# EAGLE schematic SchematicoCombinatore (EAGLE 9.5.2)
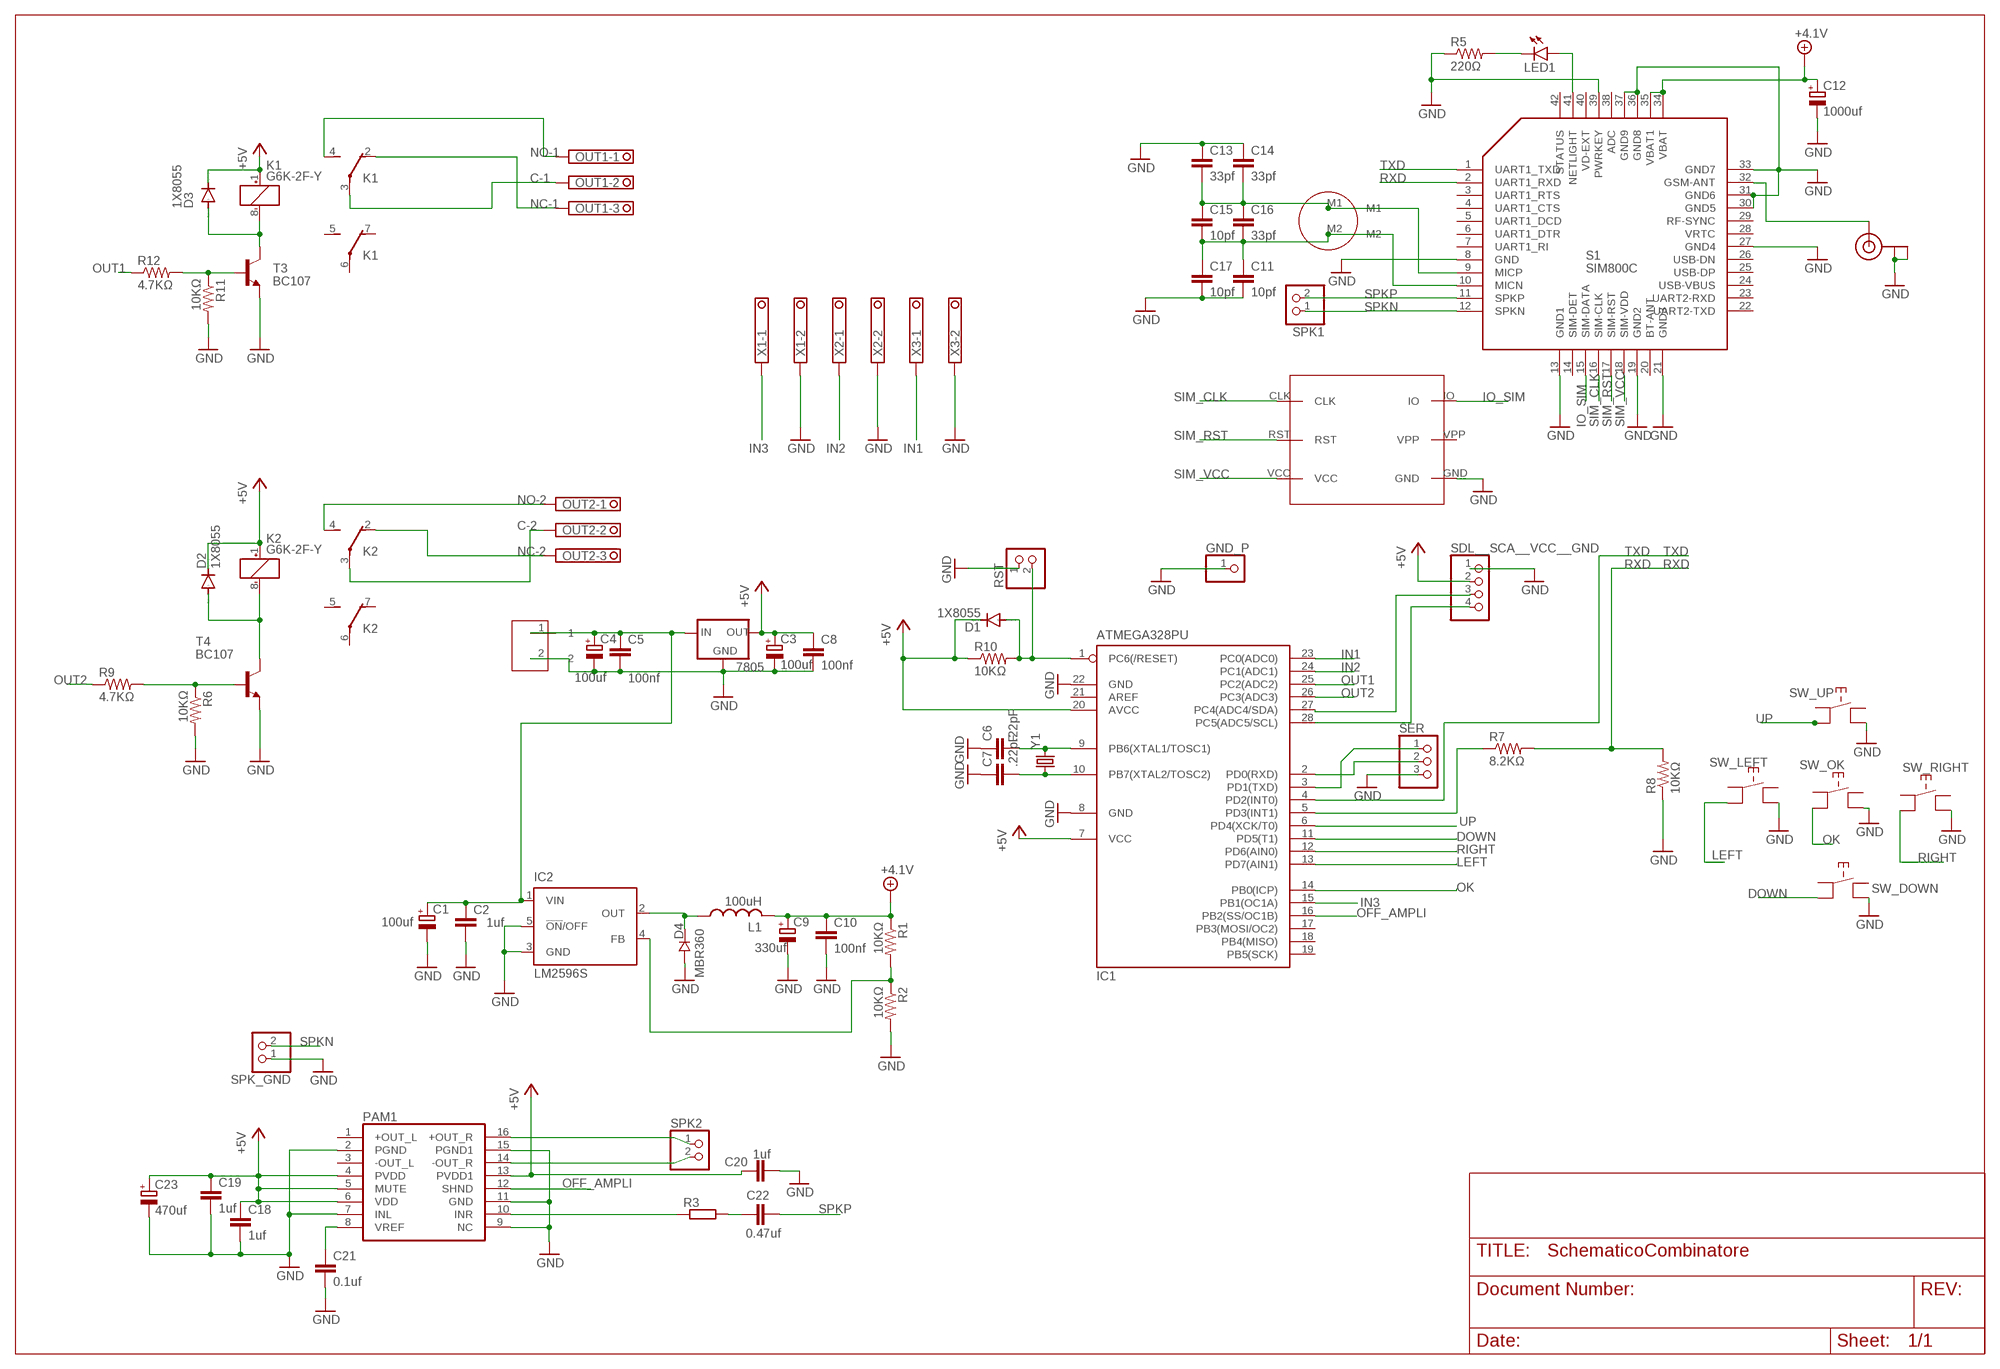
[diagram p0: schematic, sheet 1]

## Parts
7805  7805  V_REG_78XXSIDE  [78XXL]
ALIM  CONNETTORE_ALIM  [CONNETTORE_ALIM]
C1  100uf  CPOL-EU153CLV-0605  [153CLV-0605]
C2  1uf  C-EUC0805  [C0805]
C3  100uf  CPOL-EU153CLV-0605  [153CLV-0605]
C4  100uf  CPOL-EU153CLV-0605  [153CLV-0605]
C5  100nf  C-EU050-024X044  [C050-024X044]
C6  .22pF  CAPPTH  [CAP-PTH-SMALL]
C7  .22pF  CAPPTH  [CAP-PTH-SMALL]
C8  100nf  C-EU050-024X044  [C050-024X044]
C9  330uf  CPOL-EU153CLV-0605  [153CLV-0605]
C10  100nf  C-EU050-024X044  [C050-024X044]
C11  10pf  C-EUC0805  [C0805]
C12  1000uf  CPOL-EU140CLH-1014  [140CLH-1014]
C13  33pf  C-EUC0805  [C0805]
C14  33pf  C-EUC0805  [C0805]
C15  10pf  C-EUC0805  [C0805]
C16  33pf  C-EUC0805  [C0805]
C17  10pf  C-EUC0805  [C0805]
C18  1uf  C-EUC0805  [C0805]
C19  1uf  C-EUC0805  [C0805]
C20  1uf  C-EUC0805  [C0805]
C21  0.1uf  C-EUC0805  [C0805]
C22  0.47uf  C-EUC0805  [C0805]
C23  470uf  CPOL-EU153CLV-0605  [153CLV-0605]
D1  1X8055  1N4004  [DO41-10]
D2  1X8055  1N4004  [DO41-10]
D3  1X8055  1N4004  [DO41-10]
D4  MBR360  [SR360_DIODO_SMD]
GND_P  PINHD-1X1  [1X01]
IC1  ATMEGA328PU  MEGA8-P  [DIL28-3]
IC2  LM2596S  [TO263-5]
K1  G6K-2F-Y  [G6K-2F-Y]
K2  G6K-2F-Y  [G6K-2F-Y]
L1  100uH  L-US0204/7  [0204/7]
LED1  LED3MM  [LED3MM]
MIC2  MICROPHONE  [MICROFONO1]
OUT1  1751251  [1751251]
OUT2  NC  1751251  [1751251]
PAM1  PAM8403  [SOP-16]
R1  10KΩ  RESISTOR0402-RES  [0402-RES]
R2  10KΩ  RESISTOR0402-RES  [0402-RES]
R3  R-EU_R0402  [R0402]
R5  220Ω  RESISTOR0402-RES  [0402-RES]
R6  10KΩ  RESISTOR0402-RES  [0402-RES]
R7  8.2KΩ  RESISTOR0402-RES  [0402-RES]
R8  10KΩ  RESISTOR0402-RES  [0402-RES]
R9  4.7KΩ  RESISTOR0402-RES  [0402-RES]
R10  10KΩ  RESISTOR0402-RES  [0402-RES]
R11  10KΩ  RESISTOR0402-RES  [0402-RES]
R12  4.7KΩ  RESISTOR0402-RES  [0402-RES]
RST  PINHD-1X2  [1X02]
S1  SIM800C  [SIM800C]
SDL__SCA__VCC__GND  PINHD-1X4  [1X04]
SER  PINHD-1X3  [1X03]
SPK1  PINHD-1X2  [1X02]
SPK2  PINHD-1X2  [1X02]
SPK_GND  PINHD-1X2  [1X02]
SW_DOWN  PULSANTE_DIP_SWITCH  [PULSANTE_DIP_SWITCH]
SW_LEFT  PULSANTE_DIP_SWITCH  [PULSANTE_DIP_SWITCH]
SW_OK  PULSANTE_DIP_SWITCH  [PULSANTE_DIP_SWITCH]
SW_RIGHT  PULSANTE_DIP_SWITCH  [PULSANTE_DIP_SWITCH]
SW_UP  PULSANTE_DIP_SWITCH  [PULSANTE_DIP_SWITCH]
T3  BC107  [TO18]
T4  BC107  [TO18]
U$1  U.FL  [U.FL]
U$2  NANO_SIM_CARD_HOLDER  [NANO_SIM_CARD_HOLDER]
X1  1751248  [1751248]
X2  1751248  [1751248]
X3  1751248  [1751248]
Y1  CRYSTALHC49US  [HC49US]

## Nets
+4.1V: C9.+ C10.1 C12.+ L1.2 R1.1 S1.34(VBAT) S1.35(VBAT1)
+5V: 7805.OUT C3.+ C8.1 C18.1 C19.1 C20.1 C23.+ D1.C D2.C D3.C IC1.7(VCC) IC1.20(AVCC) K1.1(1:+) K2.1(1:+) PAM1.4(PVDD) PAM1.5(MUTE) PAM1.6(VDD) PAM1.13(PVDD1) R10.1 SDL__SCA__VCC__GND.2
+12: 7805.IN ALIM.1 C1.+ C2.1 C4.+ C5.1 IC2.1(VIN)
C-1: K1.3(2:P) OUT1.2
C-2: K2.3(2:P) OUT2.2
DOWN: IC1.11(PD5(T1)) SW_DOWN.3
GND: 7805.GND ALIM.2 C1.- C2.2 C3.- C4.- C5.2 C6.1 C7.1 C8.2 C9.- C10.2 C11.2 C12.- C13.1 C14.1 C17.2 C18.2 C19.2 C20.2 C21.2 C23.- D4.P$1 GND_P.1 IC1.8(GND) IC1.22(GND) IC2.3(GND) IC2.5(!ON!/OFF) PAM1.2(PGND) PAM1.7(INL) PAM1.9(NC) PAM1.11(GND) PAM1.15(PGND1) R2.2 R5.1 R6.2 R8.1 R11.2 RST.1 S1.8(GND) S1.13(GND1) S1.19(GND2) S1.21(GND3) S1.27(GND4) S1.30(GND5) S1.31(GND6) S1.33(GND7) S1.36(GND8) S1.37(GND9) S1.39(PWRKEY) SDL__SCA__VCC__GND.1 SER.3 SPK_GND.1 SW_DOWN.1 SW_LEFT.1 SW_OK.1 SW_RIGHT.1 SW_UP.1 T3.1(E) T4.1(E) U$1.1(GND) U$1.2(GND) U$2.GND X1.2 X2.2 X3.2
IN1: IC1.23(PC0(ADC0)) X3.1
IN2: IC1.24(PC1(ADC1)) X2.1
IN3: IC1.15(PB1(OC1A)) X1.1
IO_SIM: S1.15(SIM-DATA) U$2.IO
LEFT: IC1.13(PD7(AIN1)) SW_LEFT.3
N$1: D1.A IC1.1(PC6(/RESET)) R10.2 RST.2
N$2: C6.2 IC1.9(PB6(XTAL1/TOSC1)) Y1.2
N$3: C7.2 IC1.10(PB7(XTAL2/TOSC2)) Y1.1
N$4: IC1.27(PC4(ADC4/SDA)) SDL__SCA__VCC__GND.3
N$5: IC1.28(PC5(ADC5/SCL)) SDL__SCA__VCC__GND.4
N$6: C11.1 C15.2 C16.2 C17.1 MIC2.M2 S1.10(MICN)
N$7: C13.2 C14.2 C15.1 C16.1 MIC2.M1 S1.9(MICP)
N$8: PAM1.16(+OUT_R) SPK2.1
N$9: D4.P$2 IC2.2(OUT) L1.1
N$10: D2.A K2.8(1:-) T4.3(C)
N$11: D3.A K1.8(1:-) T3.3(C)
N$12: PAM1.14(-OUT_R) SPK2.2
N$13: C21.1 PAM1.8(VREF)
N$15: C22.1 R3.2
N$16: IC1.2(PD0(RXD)) SER.2
N$17: S1.32(GSM-ANT) U$1.3(SIGNAL)
N$18: PAM1.10(INR) R3.1
N$20: IC1.3(PD1(TXD)) SER.1
N$21: LED1.K(C) R5.2
N$22: IC1.5(PD3(INT1)) R7.1
N$26: LED1.A S1.41(NETLIGHT)
N$28: R11.1 R12.2 T3.2(B)
N$29: R6.1 R9.2 T4.2(B)
N$32: IC2.4(FB) R1.2 R2.1
NC-1: K1.2(2:O) OUT1.3
NC-2: K2.2(2:O) OUT2.3
NO-1: K1.4(2:S) OUT1.1
NO-2: K2.4(2:S) OUT2.1
OFF_AMPLI: IC1.16(PB2(SS/OC1B)) PAM1.12(SHND)
OK: IC1.14(PB0(ICP)) SW_OK.3
OUT1: IC1.25(PC2(ADC2)) R12.1
OUT2: IC1.26(PC3(ADC3)) R9.1
RIGHT: IC1.12(PD6(AIN0)) SW_RIGHT.3
RXD: R7.2 R8.2 S1.2(UART1_RXD)
SIM_CLK: S1.16(SIM-CLK) U$2.CLK
SIM_RST: S1.17(SIM-RST) U$2.RST
SIM_VCC: S1.18(SIM-VDD) U$2.VCC
SPKN: S1.12(SPKN) SPK1.1 SPK_GND.2
SPKP: C22.2 S1.11(SPKP) SPK1.2
TXD: IC1.4(PD2(INT0)) S1.1(UART1_TXD)
UP: IC1.6(PD4(XCK/T0)) SW_UP.3
Unconnected: IC1.17(PB3(MOSI/OC2)) IC1.18(PB4(MISO)) IC1.19(PB5(SCK)) IC1.21(AREF) K1.5(3:S) K1.6(3:P) K1.7(3:O) K2.5(3:S) K2.6(3:P) K2.7(3:O) PAM1.1(+OUT_L) PAM1.3(-OUT_L) S1.3(UART1_RTS) S1.4(UART1_CTS) S1.5(UART1_DCD) S1.6(UART1_DTR) S1.7(UART1_RI) S1.14(SIM-DET) S1.20(BT-ANT) S1.22(UART2-TXD) S1.23(UART2-RXD) S1.24(USB-VBUS) S1.25(USB-DP) S1.26(USB-DN) S1.28(VRTC) S1.29(RF-SYNC) S1.38(ADC) S1.40(VD-EXT) S1.42(STATUS) SW_DOWN.2 SW_DOWN.4 SW_LEFT.2 SW_LEFT.4 SW_OK.2 SW_OK.4 SW_RIGHT.2 SW_RIGHT.4 SW_UP.2 SW_UP.4 U$2.VPP

## Library data of the parts
7805 = SparkFun:V_REG_78XX: Voltage Regulator Standard 7805 5V regulator. IGO (Input Ground Output). Spark Fun Electronics SKU : COM-00107
ALIM = Connettore_Alim_Passo5mm:CONNETTORE_ALIM
C1 C3 C4 C9 C12 C23 = rcl:CPOL-EU: POLARIZED CAPACITOR, European symbol; SPICEPREFIX: C
C2 C5 C8 C10 C11 C13-C22 = rcl:C-EU: CAPACITOR, European symbol; SPICEPREFIX: C
C6 C7 = SparkFun:CAP: Capacitor Standard 0603 ceramic capacitor, and 0.1" leaded capacitor.
D1-D3 = diode:1N4004: DIODE general purpose rectifier, 1 A
D4 = SR360_DIODO_SMD:MBR360
GND_P = pinhead:PINHD-1X1: PIN HEADER
IC1 = atmel:MEGA8-P: MICROCONTROLLER 8 Kbytes FLASH, 1 kbytes SRAM, 512 bytes EEPROM, USART, 4-channel 10 bit ADC, 2-channel 8 bit ADC Pin compatible with Atmega48, ATMega88, ATMega168 Source: avr.lbr; OC_FARNELL: unknown; OC_NEWARK: unknown
IC2 = national-semiconductor:LM2596: SIMPLE SWITCHER® Power Converter 150 kHz 3A Step-Down Voltage Regulator Source: http://www.national.com/ds/LM/LM2596.pdf; MF: NATIONAL SEMICONDUCTOR; MPN: LM2596S-ADJ/NOPB; OC_FARNELL: 9494367; OC_NEWARK: 41K3842
K1 K2 = relay:G6K: Low Signal Relay oeiwcsnts1.omron.com/.. D20G6K0100.pdf; MF: OMRON COMPONENTS USA; MPN: G6K-2F-Y DC3; OC_FARNELL: 1690316; OC_NEWARK: 89C6451
L1 = rcl:L-US: INDUCTOR, American symbol; SPICEPREFIX: L
LED1 = led:LED: LED OSRAM: - CHIPLED LG R971, LG N971, LY N971, LG Q971, LY Q971, LO R971, LY R971 LH N974, LH R974 LS Q976, LO Q976, LY Q976 LO Q996 - Hyper CHIPLED LW Q18S LB Q993, LB Q99A, LB R99A - SideLED LS A670, LO A670, LY A670, LG A670, LP A670 LB A673, LV A673, LT A673, LW A673 LH A674 LY A675 LS A676, LA A676, LO A676, LY A676, LW A676 LS A679, LY A679, LG A679 - Hyper Micro SIDELED® LS Y876, LA Y876, LO Y876, LY Y876 LT Y87S - SmartLED LW L88C, LW L88S LB L89C, LB L89S, LG L890 LS L89K, LO L89K, LY L89K LS L896, LA L896, LO L896, LY L896 - TOPLED LS T670, LO T670, LY T670, LG T670, LP T670 LSG T670, LSP T670, LSY T670, LOP T670, LYG T670 LG T671, LOG T671, LSG T671 LB T673, LV T673, LT T673, LW T673 LH T674 LS T676, LA T676, LO T676, LY T676, LB T676, LH T676, LSB T676, LW T676 LB T67C, LV T67C, LT T67C, LS T67K, LO T67K, LY T67K, LW E67C LS E67B, LA E67B, LO E67B, LY E67B, LB E67C, LV E67C, LT E67C LW T67C LS T679, LY T679, LG T679 LS T770, LO T770, LY T770, LG T770, LP T770 LB T773, LV T773, LT T773, LW T773 LH T774 LS E675, LA E675, LY E675, LS T675 LS T776, LA T776, LO T776, LY T776, LB T776 LHGB T686 LT T68C, LB T68C - Hyper Mini TOPLED® LB M676 - Mini TOPLED Santana® LG M470 LS M47K, LO M47K, LY M47K Source: http://www.osram.convergy.de LUXEON: - LUMILED® LXK2-PW12-R00, LXK2-PW12-S00, LXK2-PW14-U00, LXK2-PW14-V00 LXK2-PM12-R00, LXK2-PM12-S00, LXK2-PM14-U00 LXK2-PE12-Q00, LXK2-PE12-R00, LXK2-PE12-S00, LXK2-PE14-T00, LXK2-PE14-U00 LXK2-PB12-K00, LXK2-PB12-L00, LXK2-PB12-M00, LXK2-PB14-N00, LXK2-PB14-P00, LXK2-PB14-Q00 LXK2-PR12-L00, LXK2-PR12-M00, LXK2-PR14-Q00, LXK2-PR14-R00 LXK2-PD12-Q00, LXK2-PD12-R00, LXK2-PD12-S00 LXK2-PH12-R00, LXK2-PH12-S00 LXK2-PL12-P00, LXK2-PL12-Q00, LXK2-PL12-R00 Source: www.luxeon.com KINGBRIGHT: KA-3528ASYC Source: www.kingbright.com
MIC2 = microfono:MICROPHONE
OUT1 OUT2 = con-phoenix-350:1751251: MKDS 1/ 3-3,5 Printklemme Nennstrom: 10 A Bemessungsspannung: 160 V Raster: 3,5 mm Polzahl: 3 Montageart: Löten Anschlussart: Schraubanschluss Anschlussrichtung vom Leiter zur Platine: 0° Source: http://eshop.phoenixcontact.com .. 1751251.pdf; OC_FARNELL: unknown; OC_NEWARK: unknown
PAM1 = PAM8403:PAM8403: Dual channel audio amplifier IC - PAM8403
R1 R2 R5-R12 = SparkFun:RESISTOR: Resistor Basic schematic elements and footprints for 0603, 1206, and PTH resistors.
R3 = rcl:R-EU_: RESISTOR, European symbol; SPICEPREFIX: R
RST SPK1 SPK2 SPK_GND = pinhead:PINHD-1X2: PIN HEADER
S1 = Sim800c:SIM800C: SIM800c quad band GSM moude
SDL__SCA__VCC__GND = pinhead:PINHD-1X4: PIN HEADER
SER = pinhead:PINHD-1X3: PIN HEADER
SW_DOWN SW_LEFT SW_OK SW_RIGHT SW_UP = PULSANTE_DIP_SWITCH:PULSANTE_DIP_SWITCH
T3 T4 = transistor:BC107: NPN TRANSISTOR
U$1 = microbuilder:U.FL: U.FL Antenna Connector
U$2 = NANO_SIM_CARD_HOLDER:NANO_SIM_CARD_HOLDER
X1-X3 = con-phoenix-350:1751248: MKDS 1/ 2-3,5 Printklemme Nennstrom: 10 A Bemessungsspannung: 160 V Raster: 3,5 mm Polzahl: 2 Montageart: Löten Anschlussart: Schraubanschluss Anschlussrichtung vom Leiter zur Platine: 0° Source: http://eshop.phoenixcontact.com .. 1751248.pdf; OC_FARNELL: unknown; OC_NEWARK: unknown
Y1 = SparkFun:CRYSTAL: Crystals Various standard crystals. Proven footprints. Spark Fun Electronics SKU : COM-00534